# Altium schematic sheet 04.Microport_Host.SchDoc
size A4; CheckedBy: <审核日期>; Author: 刘时杰; CompanyName: 广州致远电子有限公司; DocumentNumber: 4; SheetNumber: 4; SheetTotal: 8; PageSetup: Record=PageOptions|CenterHorizontal=True|CenterVertical=True|PrintScale=1.00|XCorrection=1.00|YCorrection=1.00|PrintKind=0|BorderSize=5000000|LeftOffset=0|BottomOffset=0|Orientation=2|PaperLength=1000|PaperWidth=1000|Scale=100|PaperSource=7|PrintQuality=600|MediaType=1|DitherType=10|PaperKind=A4|PrintScaleMode=1; DesignDate: 20180913; CheckDate: <审核人员>; SheetName: MicroPort接口; SheetVersion: V1.01; SheetDescription: MicroPort接口; productModel: AML166-Core; productName: AML166评估板
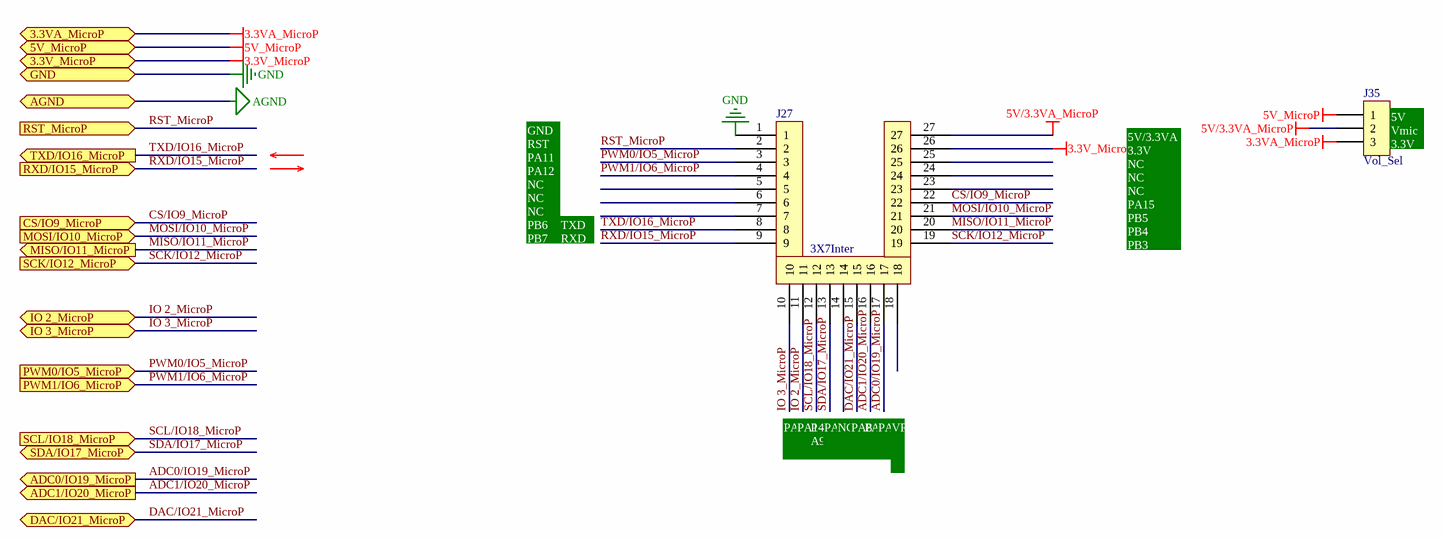
[diagram p0: 04.Microport_Host.SchDoc]

## Parts
J27  3X7Inter  [SIP-27 2.54C]
J35  Vol_Sel  [SIP-3-2.54]

## Ports
3.3V_MicroP, 3.3VA_MicroP, 5V_MicroP, ADC0/IO19_MicroP (out), ADC1/IO20_MicroP (out), AGND, CS/IO9_MicroP (in), DAC/IO21_MicroP (bidir), GND, IO 2_MicroP (bidir), IO 3_MicroP (bidir), MISO/IO11_MicroP (out), MOSI/IO10_MicroP (in), PWM0/IO5_MicroP (in), PWM1/IO6_MicroP (in), RST_MicroP (in), RXD/IO15_MicroP (in), SCK/IO12_MicroP (in), SCL/IO18_MicroP (in), SDA/IO17_MicroP (bidir), TXD/IO16_MicroP (out)

## Nets
3.3V_MicroP: J27.26 ; port 3.3V_MicroP
3.3VA_MicroP: J35.3 ; port 3.3VA_MicroP
5V/3.3VA_MicroP: J27.27 J35.2
5V_MicroP: J35.1 ; port 5V_MicroP
AGND: port AGND
GND: J27.1 ; port GND
ADC0/IO19_MicroP: J27.17 ; port ADC0/IO19_MicroP
ADC1/IO20_MicroP: J27.16 ; port ADC1/IO20_MicroP
CS/IO9_MicroP: J27.22 ; port CS/IO9_MicroP
DAC/IO21_MicroP: J27.15 ; port DAC/IO21_MicroP
IO 2_MicroP: J27.11 ; port IO 2_MicroP
IO 3_MicroP: J27.10 ; port IO 3_MicroP
MISO/IO11_MicroP: J27.20 ; port MISO/IO11_MicroP
MOSI/IO10_MicroP: J27.21 ; port MOSI/IO10_MicroP
PWM0/IO5_MicroP: J27.3 ; port PWM0/IO5_MicroP
PWM1/IO6_MicroP: J27.4 ; port PWM1/IO6_MicroP
RST_MicroP: J27.2 ; port RST_MicroP
RXD/IO15_MicroP: J27.9 ; port RXD/IO15_MicroP
SCK/IO12_MicroP: J27.19 ; port SCK/IO12_MicroP
SCL/IO18_MicroP: J27.12 ; port SCL/IO18_MicroP
SDA/IO17_MicroP: J27.13 ; port SDA/IO17_MicroP
TXD/IO16_MicroP: J27.8 ; port TXD/IO16_MicroP

Not connected (* = marked no-connect by the designer): J27 5 6 7 14 18 23 24 25

## Notes on the sheet
- (near J35) 5V
- (near J35) Vmic
  3.3V
- GND
  RST
  PA11
  PA12
  NC
  NC
  NC
  PB6
  PB7
- TXD
- RXD
- 5V/3.3VA
  3.3V
  NC
  NC
  NC
  PA15
  PB5
  PB4
  PB3
- PA13
- PA14
- P
  A9
- PA10
- NC
- PA8
- PA0
- PA1
- VREF
- 1
- #
- 修改日期
- 修改内容
- 2
- 3
- 设计人员
- 审核人员
- 设计日期
- 审核日期
- 产品名称
- 图纸名称
- 产品型号
- 图纸描述
- 图纸版本
- A4

## Library data of the parts
J27 = 3X7Inter: 物料代码: 1.10.11.0074
J35 = CON3: Connector; 物料代码: 1.10.03.0164